# Altium schematic sheet 3.GSM Module.SchDoc
size A4
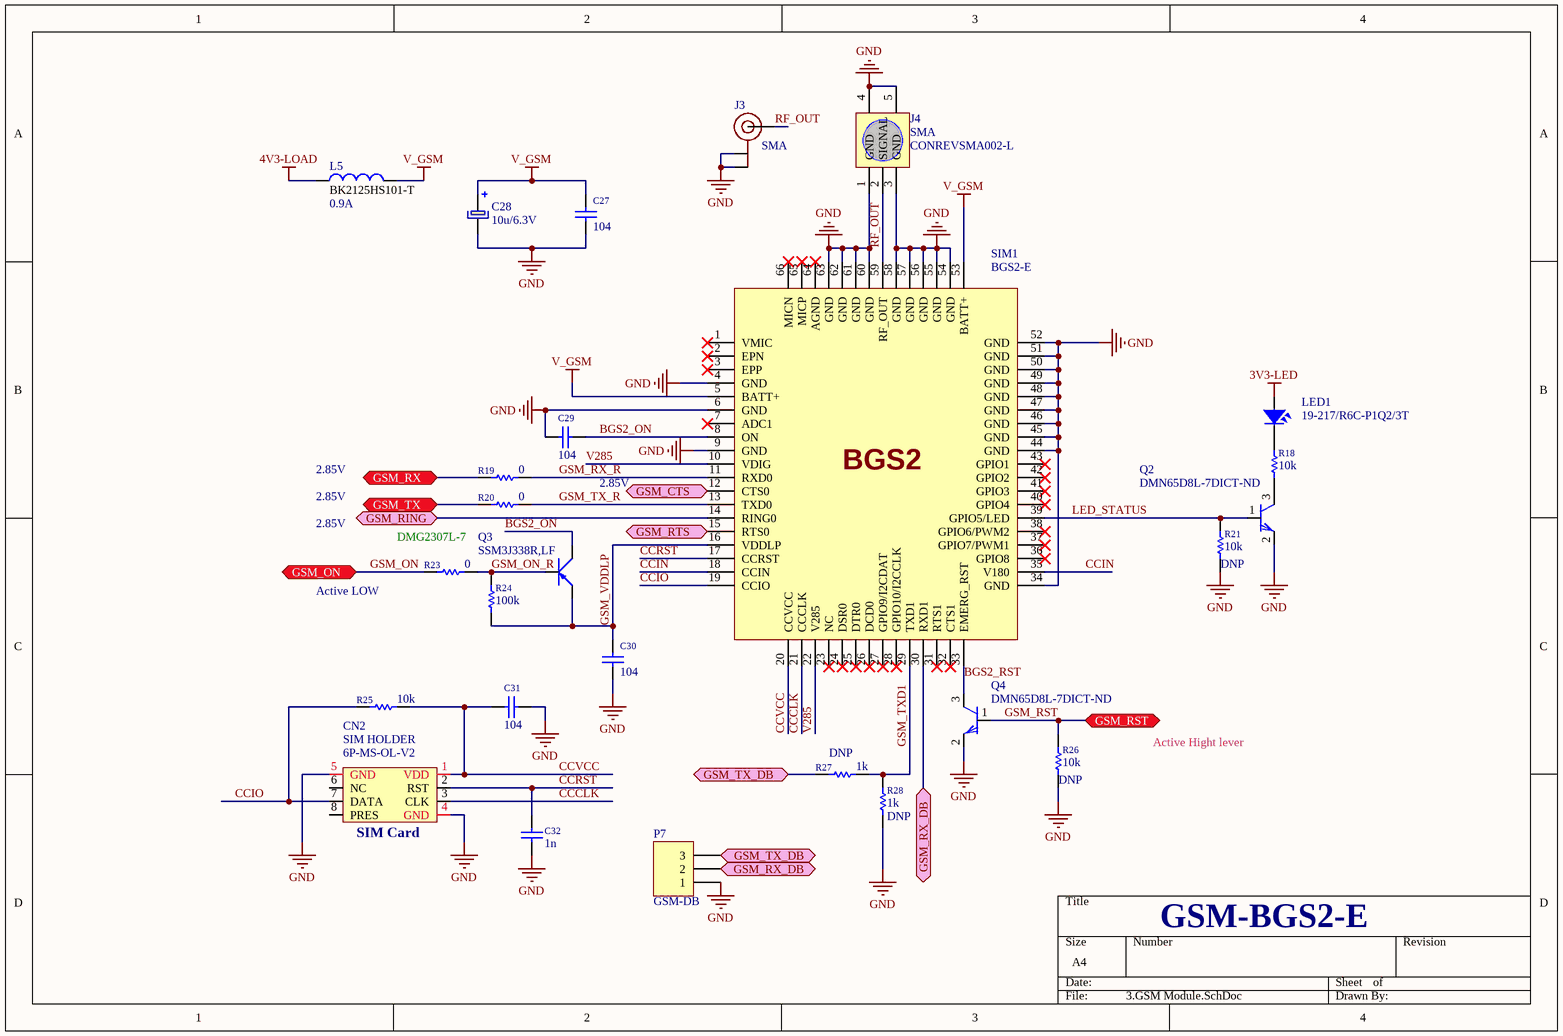
[diagram p0: 3.GSM Module.SchDoc]

## Parts
C27  104  [sm-0603-c]
C28  value 10u/6.3V  [Tantalum Case A]  (hidden comment: 10u)
C29  104  [sm-0603-c]
C30  104  [sm-0603-c]
C31  104  [sm-0603-c]
C32  1n  [sm-0603-c]
CN2  SIM HOLDER  value 6P-MS-OL-V2  [Sim card holder 1]
J3  SMA  [U.FL]
J4  SMA  value CONREVSMA002-L  [SMA - through hole]
L5  Current: 0.9A  [L2012-0805]  (hidden comment: BK2125HS101-T)
LED1  19-217/R6C-P1Q2/3T  [LED0603]
P7  GSM-DB  [HEADER 3PIN.CAOVANHUONG]
Q2  DMN65D8L-7DICT-ND  [SOT23N]
Q3  SSM3J338R,LF  [SOT23B]
Q4  DMN65D8L-7DICT-ND  [SOT23N]
R18  10k  [SM-0603-R]
R19  0  [SM-0603-R]
R20  0  [SM-0603-R]
R21  10k  [SM-0603-R]
R23  0  [SM-0603-R]
R24  100k  [SM-0603-R]
R25  10k  [SM-0603-R]
R26  10k  [SM-0603-R]
R27  1k  [SM-0603-R]
R28  1k  [SM-0603-R]
SIM1  BGS2-E  [BGS2]

## Ports
GSM_CTS, GSM_ON, GSM_RING, GSM_RST, GSM_RTS, GSM_RX, GSM_RX_DB, GSM_TX, GSM_TX_DB

## Nets
3V3-LED: LED1.1
4V3-LOAD: L5.1
GND: C27.2 C28.2 C29.1 C30.2 C31.2 C32.2 CN2.4(GND) CN2.5(GND) J3.P$1(GND@0) J3.P$2(GND@1) J4.1(GND) J4.3(GND) J4.4 J4.5 P7.1 Q2.2(E) Q4.2(E) R21.1 R26.1 R28.1 SIM1.4(GND) SIM1.6(GND) SIM1.9(GND) SIM1.34(GND) SIM1.44(GND) SIM1.45(GND) SIM1.46(GND) SIM1.47(GND) SIM1.48(GND) SIM1.49(GND) SIM1.50(GND) SIM1.51(GND) SIM1.52(GND) SIM1.54(GND) SIM1.55(GND) SIM1.56(GND) SIM1.57(GND) SIM1.58(GND) SIM1.60(GND) SIM1.61(GND) SIM1.62(GND) SIM1.63(GND)
V_GSM: C27.1 C28.1 L5.2 SIM1.5(BATT+) SIM1.53(BATT+)
BGS2_ON: C29.2 Q3.2(C) SIM1.8(ON)
BGS2_RST: Q4.3(C) SIM1.33(EMERG_RST)
CCCLK: CN2.3(CLK) SIM1.21(CCCLK)
CCIN: SIM1.18(CCIN) SIM1.35(V180)
CCIO: CN2.7(DATA) R25.1 SIM1.19(CCIO)
CCRST: C32.1 CN2.2(RST) SIM1.17(CCRST)
CCVCC: C31.1 CN2.1(VDD) R25.2 SIM1.20(CCVCC)
GSM_CTS: SIM1.12(CTS0) ; port GSM_CTS
GSM_ON: R23.2 ; port GSM_ON
GSM_ON_R: Q3.3(B) R23.1 R24.2
GSM_RING: SIM1.14(RING0) ; port GSM_RING
GSM_RST: Q4.1(B) R26.2 ; port GSM_RST
GSM_RTS: SIM1.15(RTS0) ; port GSM_RTS
GSM_RX: R19.2 ; port GSM_RX
GSM_RX_DB: P7.2 SIM1.30(RXD1) ; port GSM_RX_DB
GSM_RX_R: R19.1 SIM1.11(RXD0)
GSM_TX: R20.2 ; port GSM_TX
GSM_TX_DB: P7.3 R27.1 ; port GSM_TX_DB
GSM_TX_R: R20.1 SIM1.13(TXD0)
GSM_TXD1: R27.2 R28.2 SIM1.29(TXD1)
GSM_VDDLP: C30.1 Q3.1(E) R24.1 SIM1.16(VDDLP)
LED_STATUS: Q2.1(B) R21.2 SIM1.39(GPIO5/LED)
RF_OUT: J3.P$3(SIGNAL) J4.2(SIGNAL) SIM1.59(RF_OUT)
V285: SIM1.10(VDIG) SIM1.22(V285)
NetLED1_2: LED1.2 R18.2
NetQ2_3: Q2.3(C) R18.1

Not connected (* = marked no-connect by the designer): CN2 6(NC) 8(PRES); SIM1 1(VMIC)* 2(EPN)* 3(EPP)* 7(ADC1)* 23(NC)* 24(DSR0)* 25(DTR0)* 26(DCD0)* 27(GPIO9/I2CDAT)* 28(GPIO10/I2CCLK)* 31(RTS1)* 32(CTS1)* 36(GPIO8)* 37(GPIO7/PWM1)* 38(GPIO6/PWM2)* 40(GPIO4)* 41(GPIO3)* 42(GPIO2)* 43(GPIO1)* 64(AGND)* 65(MICP)* 66(MICN)*

## Notes on the sheet
- 2.85V
- DMG2307L-7
- Active LOW
- Active Hight lever
- GSM-BGS2-E
- (in symbol Sim Card Holder) SIM Card

## Library data of the parts
C27 C29-C31 = Capacitor: CAP CER 10000PF 16V 0603; Manufacturer: Taiyo Yuden; Manufacturer P/N: EMK107SD103JA-T; Vendor: DIGIKEY; Vendor P/N: 587-1093-1-ND; Package: 0603; Part: EMK107SD103JA-T; Value: 104; Voltage: 16V
C28 = Capacitor elec: CAP CER 10UF 6.3V X5R 1206; Manufacturer: Samsung Electro-Mechanics; Manufacturer P/N: CL31A106MQHNNNE; Tollerance: 10%; Vendor: DIGIKEY; Vendor P/N: 1276-3045-1-ND; DNP: *; Package: 1206; Part: 10u; Price: *; Voltage: 6.3V
C32 = Capacitor: CAP CER 1000PF 50V X7R 0603; Manufacturer: KEMET; Manufacturer P/N: C0603C102K5RACTU; Vendor: DIGIKEY; Vendor P/N: 399-1082-1-ND; Voltage: 16V; Tollerance: 10%; Part: 1n; Value: 1n; Package: 0603
CN2 = Sim Card Holder: Micro SIM Card Socket 6pin, Open-Lock; Manufacturer: UNKNOW; Vendor: http://thegioiic.com; Manufacturer P/N: 6P-MS-OL-V2; Package: CONN_6P; Part: 6P-MS-OL-V2; Vendor P/N: 6P-MS-OL-V2; DNP: *
J3 = U.FL: PROD_ID: CONN-09193; SF_ID: WRL-09144
J4 = SMA RF Connector: CONN RP-SMA RCPT R/A 50 OHM PCB; Manufacturer: Linx Technologies Inc.; Vendor: DIGIKEY; Vendor P/N: CONREVSMA002-L-ND; DNP: *; Manufacturer P/N: CONREVSMA002-L; Package: RP-SMA; Part: CONREVSMA002-L; Price: *
L5 = Inductor: FERRITE BEAD 100 OHM 0805 1LN; Manufacturer: Taiyo Yuden; Vendor: DIGIKEY; Vendor P/N: 587-1903-1-ND; Res: 100 OHM; Value: BK2125HS101-T; DNP: *; Manufacturer P/N: BK2125HS101-T; Package: 0805; Part: BK2125HS101-T; Price: *
LED1 = LED: LED Red Water Clear SMD-0603; Manufacturer: Everlight; Value: 19-217/R6C-P1Q2/3T; DNP: *; Manufacturer P/N: 19-217/R6C-P1Q2/3T; Package: 0603; Part: 19-217/R6C-P1Q2/3T; Vendor: www.tme.vn; Vendor P/N: 19-217/R6C-P1Q2/3T
P7 = Header 3: Header, 3-Pin; LatestRevisionDate: 17-Jul-2002; LatestRevisionNote: Re-released for DXP Platform.; Publisher: Altium Limited
Q2 Q4 = C1815: MOSFET N-CH 60V 310MA SOT23; Manufacturer: Diodes Incorporated; Vendor: DIGIKEY; Manufacturer P/N: DMN65D8L-7DICT-ND; Vendor P/N: DMN65D8L-7DICT-ND; Part: DMN65D8L-7DICT-ND; Value: DMN65D8L-7DICT-ND; Voltage: 60V; Current: 310mA; Package: SOT23
Q3 = A1015: MOSFET P-CH 12V 6A SOT23F; Manufacturer: Toshiba Semiconductor and Storage; Vendor: DIGIKEY; Vendor P/N: SSM3J338RLFCT-ND; Value: SSM3J338R,LF; DNP: *; Manufacturer P/N: SSM3J338R,LF; Package: SOT23F; Part: SSM3J338R,LF; Price: *; Voltage: 12V; Current: 6A
R18 R21 R25 R26 = Resistor: RES SMD 10K OHM 5% 1/10W 0603; Manufacturer: Panasonic Electronic Components; Manufacturer P/N: ERJ-3GEYJ103V; Vendor: DIGIKEY; Vendor P/N: P10KGCT-ND; Tollerance: 5%; Part: 10k; Value: 10k; Package: 0603; Power: 1/10W
  R18 R25: DNP: *
  R21 R26: DNP: DNP
R19 R20 R23 = Resistor: RES SMD 0 OHM JUMPER 1/10W 0603; Manufacturer: Panasonic Electronic Components; Manufacturer P/N: ERJ-3GEY0R00V; Vendor: DIGIKEY; Vendor P/N: P0.0GCT-ND; Tollerance: 5%; Part: 0; Value: 0; Package: 0603; Power: 1/10W
R24 = Resistor: RES SMD 100K OHM 5% 1/10W 0603; Manufacturer: Panasonic Electronic Components; Manufacturer P/N: ERJ-3GEYJ104V; Vendor: DIGIKEY; Vendor P/N: P100KGCT-ND; Tollerance: 5%; Part: 100k; Value: 100k; Package: 0603; Power: 1/10W; DNP: *
R27 R28 = Resistor: RES SMD 1K OHM 5% 1/10W 0603; Manufacturer: Panasonic Electronic Components; Manufacturer P/N: ERJ-3GEYJ102V; Vendor: DIGIKEY; Vendor P/N: P1.0KGCT-ND; Tollerance: 5%; Part: 1k; Value: 1k; Package: 0603; Power: 1/10W; DNP: DNP
SIM1 = BGS2: GSM MODULE 2.5G; Manufacturer: Cinterion - Gemalto; Vendor: rpc.vn; DNP: *; Manufacturer P/N: BGS2-E; Package: MD_BGS2-E; Part: BGS2-E; Power: *; Price: *; Vendor P/N: BGS2-E